# Altium schematic sheet MicroPlayerSCH.SchDoc
size A2; SheetNumber: 1; SheetTotal: 1
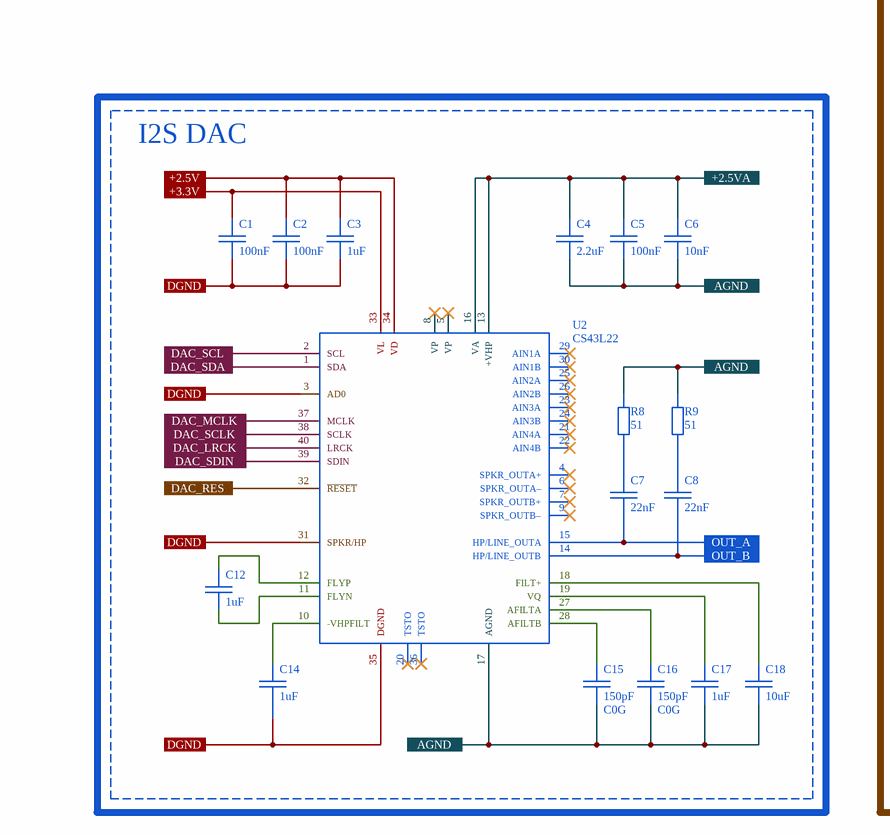
[diagram p0: MicroPlayerSCH.SchDoc, top left]
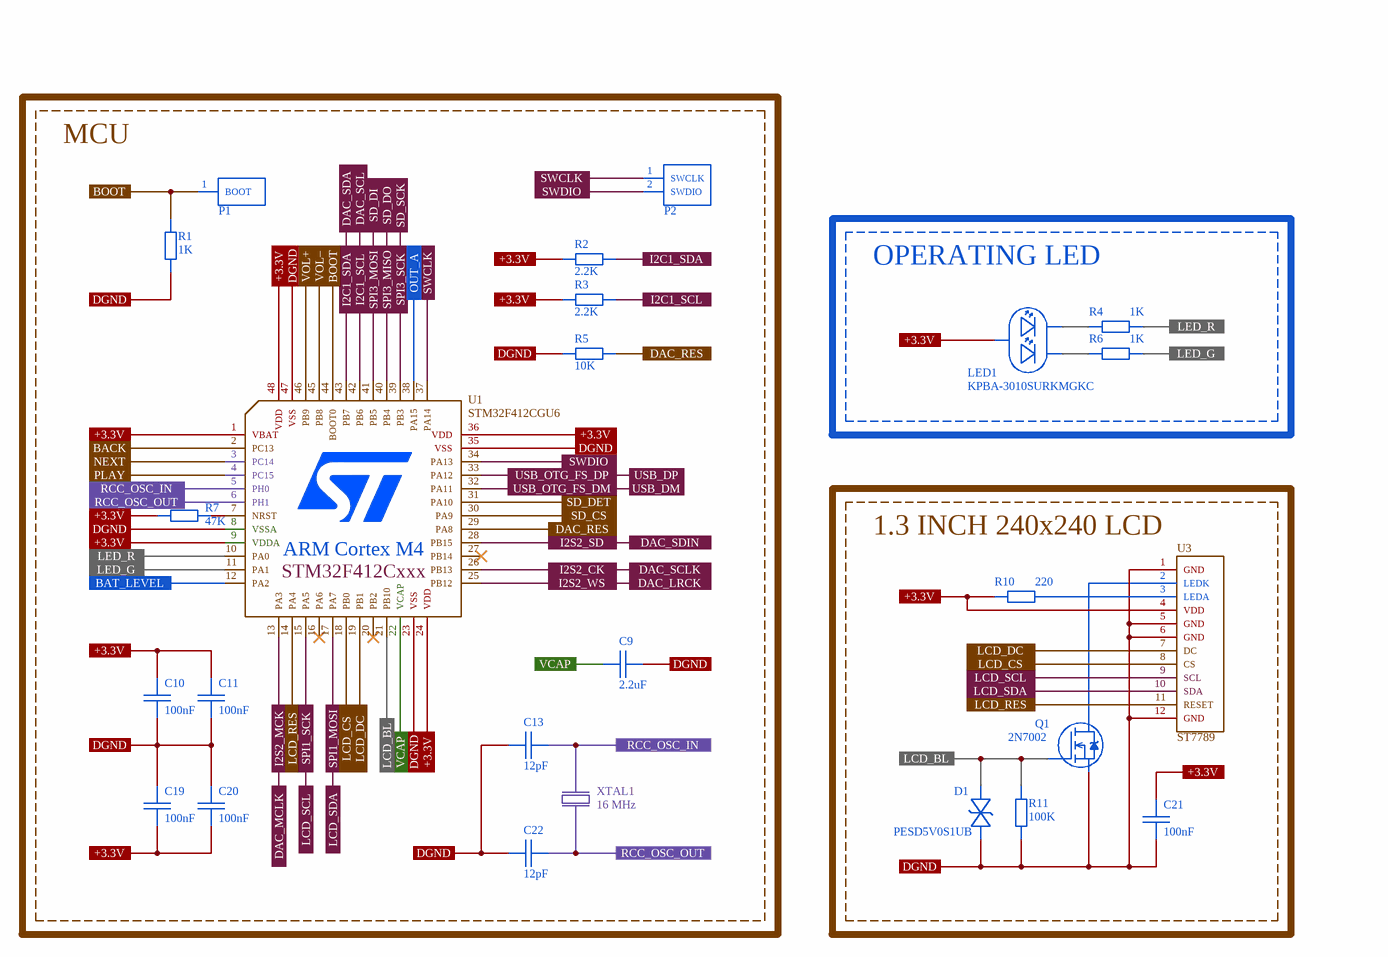
[diagram p1: MicroPlayerSCH.SchDoc, top right]
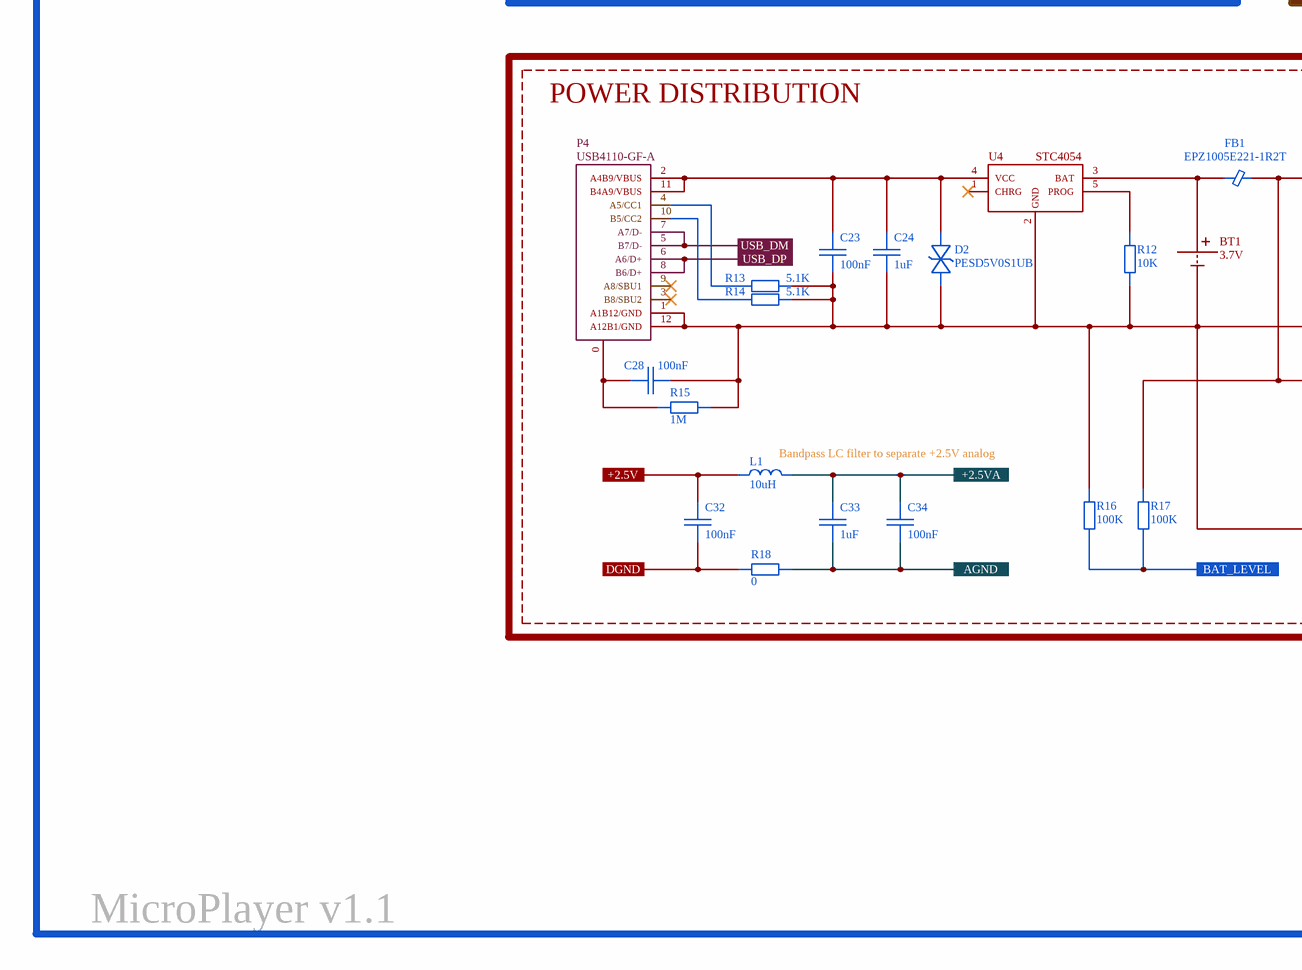
[diagram p2: MicroPlayerSCH.SchDoc, bottom left]
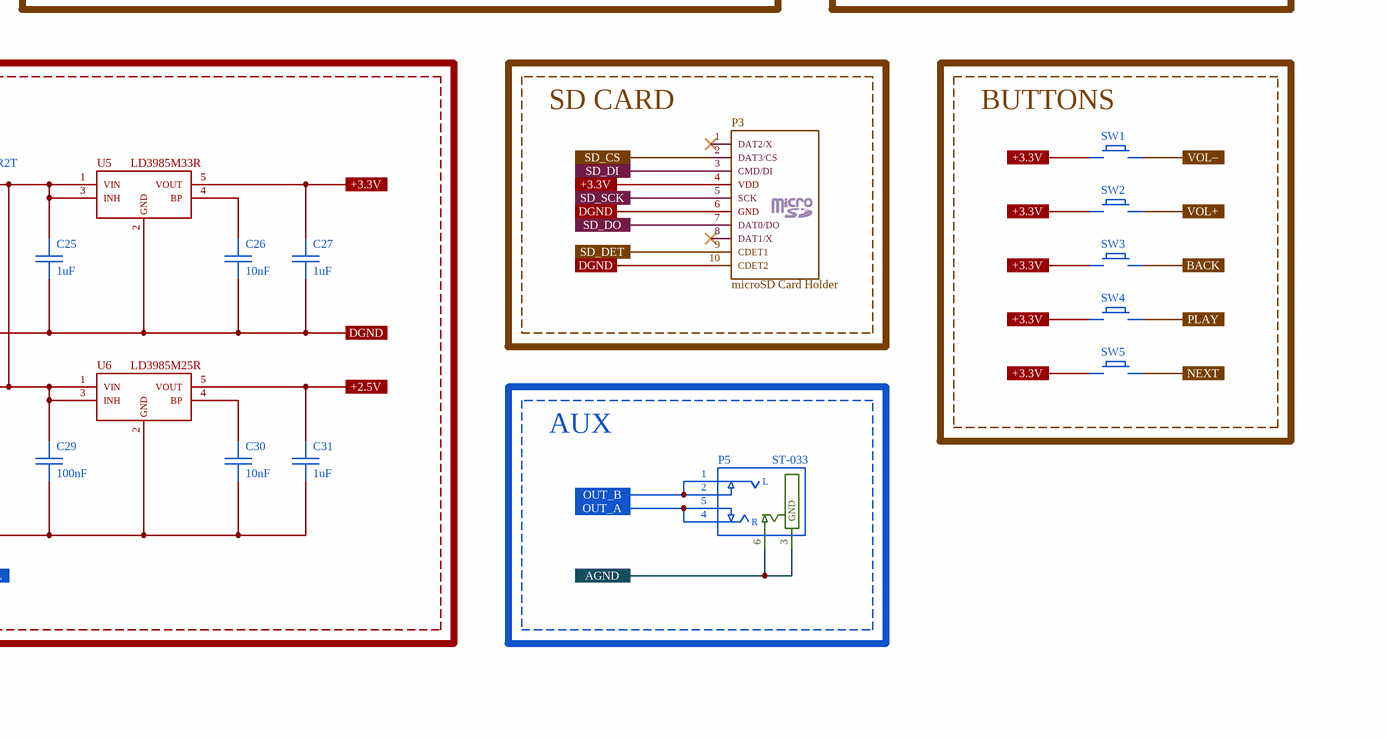
[diagram p3: MicroPlayerSCH.SchDoc, bottom right]

## Parts
BT1  3.7V  [_2-PAD-SM]
C1  100nF  [C0402]
C2  100nF  [C0402]
C3  1uF  [C0402]
C4  2.2uF  [C0402]
C5  100nF  [C0402]
C6  10nF  [C0402]
C7  22nF  [C0402]
C8  22nF  [C0402]
C9  2.2uF  [C0402]
C10  100nF  [C0402]
C11  100nF  [C0402]
C12  1uF  [C0402]
C13  12pF  [C0402]
C14  1uF  [C0402]
C15  150pF  Note: C0G  [C0402]
C16  150pF  Note: C0G  [C0402]
C17  1uF  [C0402]
C18  10uF  [C0402]
C19  100nF  [C0402]
C20  100nF  [C0402]
C21  100nF  [C0402]
C22  12pF  [C0402]
C23  100nF  [C0402]
C24  1uF  [C0402]
C25  1uF  [C0402]
C26  10nF  [C0402]
C27  1uF  [C0402]
C28  100nF  [C0402]
C29  100nF  [C0402]
C30  10nF  [C0402]
C31  1uF  [C0402]
C32  100nF  [C0402]
C33  1uF  [C0402]
C34  100nF  [C0402]
D1  PESD5V0S1UB  [SOD-523]
D2  PESD5V0S1UB  [SOD-523]
FB1  EPZ1005E221-1R2T  [L0402]
L1  10uH  [L0402]
LED1  KPBA-3010SURKMGKC  [LED-3010]
P1  P1  [_1-PAD-SM]  (value not drawn)
P2  P2  [_2-PAD-SM]  (value not drawn)
P3  microSD Card Holder  [SD-05]
P4  USB4110-GF-A  [USB-TYPE-C]
P5  ST-033  [_3-PAD-TH]
Q1  2N7002  [SOT-23-3-312]
R1  1K  [R0402]
R2  2.2K  [R0402]
R3  2.2K  [R0402]
R4  1K  [R0402]
R5  10K  [R0402]
R6  1K  [R0402]
R7  47K  [R0402]
R8  51  [R0402]
R9  51  [R0402]
R10  220  [R0402]
R11  100K  [R0402]
R12  10K  [R0402]
R13  5.1K  [R0402]
R14  5.1K  [R0402]
R15  1M  [R0402]
R16  100K  [R0402]
R17  100K  [R0402]
R18  0  [R0402]
SW1  (no value)  [BUT-SMD-4X3.5X2MM]
SW2  (no value)  [BUT-SMD-4X3.5X2MM]
SW3  (no value)  [BUT-SMD-4X3.5X2MM]
SW4  (no value)  [BUT-SMD-4X3.5X2MM]
SW5  (no value)  [BUT-SMD-4X3.5X2MM]
U1  STM32F412CGU6  [UFQFPN48]
U2  CS43L22  [QFN40]
U3  ST7789  [1.3INCH_LCD_WELDED]
U4  STC4054  [SOT-23-5]
U5  LD3985M33R  [SOT-23-5]
U6  LD3985M25R  [SOT-23-5]
XTAL1  16 MHz  [7U]

## Blocks framed on the sheet
MCU: C9-C11 C13 C19 C20 C22 P1 P2 R1-R3 R5 R7 U1 XTAL1
I2S DAC: C1-C8 C12 C14-C18 R8 R9 U2
OPERATING LED: LED1 R4 R6
1.3 INCH 240x240 LCD: C21 D1 Q1 R10 R11 U3
POWER DISTRIBUTION: BT1 C23-C34 D2 FB1 L1 P4 R12-R18 U4-U6
SD CARD: P3
BUTTONS: SW1-SW5
AUX: P5

## Ports
+2.5V (see MicroPlayerSCH[2A], MicroPlayerSCH[2D]), +2.5V (see MicroPlayerSCH[2A], MicroPlayerSCH[5C]), +2.5V (see MicroPlayerSCH[2D], MicroPlayerSCH[5C]), +2.5VA (see MicroPlayerSCH[3A]), +2.5VA (see MicroPlayerSCH[3D]), +3.3V (see MicroPlayerSCH[2B], MicroPlayerSCH[4B], MicroPlayerSCH[4C], MicroPlayerSCH[5A], MicroPlayerSCH[5B], MicroPlayerSCH[5C], MicroPlayerSCH[6B], MicroPlayerSCH[7B], MicroPlayerSCH[7C]), +3.3V (see MicroPlayerSCH[2B], MicroPlayerSCH[4B], MicroPlayerSCH[4C], MicroPlayerSCH[5A], MicroPlayerSCH[5B], MicroPlayerSCH[5C], MicroPlayerSCH[6B], MicroPlayerSCH[7C]), +3.3V (see MicroPlayerSCH[2B], MicroPlayerSCH[4B], MicroPlayerSCH[5A], MicroPlayerSCH[5B], MicroPlayerSCH[5C], MicroPlayerSCH[6B], MicroPlayerSCH[7B], MicroPlayerSCH[7C]), +3.3V (see MicroPlayerSCH[4B], MicroPlayerSCH[4C], MicroPlayerSCH[5A], MicroPlayerSCH[5B], MicroPlayerSCH[5C], MicroPlayerSCH[6B], MicroPlayerSCH[7B], MicroPlayerSCH[7C]), AGND (see MicroPlayerSCH[3B], MicroPlayerSCH[3C], MicroPlayerSCH[3D]), AGND (see MicroPlayerSCH[3B], MicroPlayerSCH[3C], MicroPlayerSCH[3D], MicroPlayerSCH[5D]), AGND (see MicroPlayerSCH[3B], MicroPlayerSCH[3C], MicroPlayerSCH[5D]), AGND (see MicroPlayerSCH[3B], MicroPlayerSCH[3D], MicroPlayerSCH[5D]), BACK (see MicroPlayerSCH[4B]), BACK (see MicroPlayerSCH[7C]), BAT_LEVEL (see MicroPlayerSCH[4B]), BAT_LEVEL (see MicroPlayerSCH[4D]), BOOT (see MicroPlayerSCH[4A]), BOOT (see MicroPlayerSCH[5A]), DAC_LRCK (see MicroPlayerSCH[2B]), DAC_LRCK (see MicroPlayerSCH[6B]), DAC_MCLK (see MicroPlayerSCH[2B]), DAC_MCLK (see MicroPlayerSCH[5C]), DAC_RES (see MicroPlayerSCH[2B], MicroPlayerSCH[5B]), DAC_RES (see MicroPlayerSCH[2B], MicroPlayerSCH[6B]), DAC_RES (see MicroPlayerSCH[5B], MicroPlayerSCH[6B]), DAC_SCL (see MicroPlayerSCH[2B]), DAC_SCL (see MicroPlayerSCH[5A]), DAC_SCLK (see MicroPlayerSCH[2B]), DAC_SCLK (see MicroPlayerSCH[6B]), DAC_SDA (see MicroPlayerSCH[2B]), DAC_SDA (see MicroPlayerSCH[5A]), DAC_SDIN (see MicroPlayerSCH[2B]), DAC_SDIN (see MicroPlayerSCH[6B]), DGND (see MicroPlayerSCH[2B], MicroPlayerSCH[2C], MicroPlayerSCH[2D], MicroPlayerSCH[4A], MicroPlayerSCH[4B], MicroPlayerSCH[5A], MicroPlayerSCH[5B], MicroPlayerSCH[5C], MicroPlayerSCH[6B]), DGND (see MicroPlayerSCH[2B], MicroPlayerSCH[2C], MicroPlayerSCH[2D], MicroPlayerSCH[4A], MicroPlayerSCH[4B], MicroPlayerSCH[5A], MicroPlayerSCH[5B], MicroPlayerSCH[5C], MicroPlayerSCH[6B], MicroPlayerSCH[6C]), DGND (see MicroPlayerSCH[2B], MicroPlayerSCH[2C], MicroPlayerSCH[2D], MicroPlayerSCH[4A], MicroPlayerSCH[4B], MicroPlayerSCH[5A], MicroPlayerSCH[5B], MicroPlayerSCH[5C], MicroPlayerSCH[6C]), DGND (see MicroPlayerSCH[2B], MicroPlayerSCH[2C], MicroPlayerSCH[2D], MicroPlayerSCH[4A], MicroPlayerSCH[4B], MicroPlayerSCH[5B], MicroPlayerSCH[5C], MicroPlayerSCH[6B], MicroPlayerSCH[6C]), DGND (see MicroPlayerSCH[2B], MicroPlayerSCH[2C], MicroPlayerSCH[2D], MicroPlayerSCH[4B], MicroPlayerSCH[5A], MicroPlayerSCH[5B], MicroPlayerSCH[5C], MicroPlayerSCH[6B], MicroPlayerSCH[6C]), DGND (see MicroPlayerSCH[2B], MicroPlayerSCH[2C], MicroPlayerSCH[4A], MicroPlayerSCH[4B], MicroPlayerSCH[5A], MicroPlayerSCH[5B], MicroPlayerSCH[5C], MicroPlayerSCH[6B], MicroPlayerSCH[6C]), DGND (see MicroPlayerSCH[2B], MicroPlayerSCH[2D], MicroPlayerSCH[4A], MicroPlayerSCH[4B], MicroPlayerSCH[5A], MicroPlayerSCH[5B], MicroPlayerSCH[5C], MicroPlayerSCH[6B], MicroPlayerSCH[6C]), I2C1_SCL (see MicroPlayerSCH[5B]), I2C1_SCL (see MicroPlayerSCH[6A]), I2C1_SDA (see MicroPlayerSCH[5B]), I2C1_SDA (see MicroPlayerSCH[6A]), I2S2_CK, I2S2_MCK, I2S2_SD, I2S2_WS, LCD_BL (see MicroPlayerSCH[5B]), LCD_BL (see MicroPlayerSCH[6B]), LCD_CS (see MicroPlayerSCH[5B]), LCD_CS (see MicroPlayerSCH[6B]), LCD_DC (see MicroPlayerSCH[5B]), LCD_DC (see MicroPlayerSCH[6B]), LCD_RES (see MicroPlayerSCH[5B]), LCD_RES (see MicroPlayerSCH[6B]), LCD_SCL (see MicroPlayerSCH[5C]), LCD_SCL (see MicroPlayerSCH[6B]), LCD_SDA (see MicroPlayerSCH[5C]), LCD_SDA (see MicroPlayerSCH[6B]), LED_G (see MicroPlayerSCH[4B]), LED_G (see MicroPlayerSCH[7B]), LED_R (see MicroPlayerSCH[4B]), LED_R (see MicroPlayerSCH[7B]), NEXT (see MicroPlayerSCH[4B]), NEXT (see MicroPlayerSCH[7C]), OUT_A (see MicroPlayerSCH[3B], MicroPlayerSCH[5A]), OUT_A (see MicroPlayerSCH[3B], MicroPlayerSCH[5D]), OUT_A (see MicroPlayerSCH[5A], MicroPlayerSCH[5D]), OUT_B (see MicroPlayerSCH[3B]), OUT_B (see MicroPlayerSCH[5D]), PLAY (see MicroPlayerSCH[4B]), PLAY (see MicroPlayerSCH[7C]), RCC_OSC_IN (see MicroPlayerSCH[4B]), RCC_OSC_IN (see MicroPlayerSCH[5B]), RCC_OSC_OUT (see MicroPlayerSCH[4B]), RCC_OSC_OUT (see MicroPlayerSCH[5C]), SD_CS (see MicroPlayerSCH[5B]), SD_CS (see MicroPlayerSCH[5C]), SD_DET (see MicroPlayerSCH[5B]), SD_DET (see MicroPlayerSCH[5C]), SD_DI (see MicroPlayerSCH[5A]), SD_DI (see MicroPlayerSCH[5C]), SD_DO (see MicroPlayerSCH[5A]), SD_DO (see MicroPlayerSCH[5C]), SD_SCK (see MicroPlayerSCH[5A]), SD_SCK (see MicroPlayerSCH[5C]), SPI1_MOSI, SPI1_SCK, SPI3_MISO, SPI3_MOSI, SPI3_SCK, SWCLK (see MicroPlayerSCH[5A]), SWDIO (see MicroPlayerSCH[5A]), SWDIO (see MicroPlayerSCH[5B]), USB_DM (see MicroPlayerSCH[2C]), USB_DM (see MicroPlayerSCH[6B]), USB_DP (see MicroPlayerSCH[2C]), USB_DP (see MicroPlayerSCH[6B]), USB_OTG_FS_DM, USB_OTG_FS_DP, VCAP (see MicroPlayerSCH[5B]), VOL+ (see MicroPlayerSCH[5A]), VOL+ (see MicroPlayerSCH[7C]), VOL– (see MicroPlayerSCH[5A]), VOL– (see MicroPlayerSCH[7C])

## Nets
+2.5V: C2.2 C3.2 C31.2 C32.1 L1.1 U2.34(VD) U6.5(VOUT) ; port +2.5V
+2.5VA: C4.2 C5.2 C6.2 C33.1 C34.1 L1.2 U2.13(+VHP) U2.16(VA) ; port +2.5VA
+3.3V: C1.2 C10.2 C11.2 C19.1 C20.1 C21.2 C27.2 LED1.1 P3.4(VDD) R2.1 R3.1 R7.1 R10.1 SW1.1 SW2.1 SW3.1 SW4.1 SW5.1 U1.1(VBAT) U1.9(VDDA) U1.24(VDD) U1.36(VDD) U1.48(VDD) U2.33(VL) U3.4(VDD) U5.5(VOUT) ; port +3.3V
AGND: C4.1 C5.1 C6.1 C15.1 C16.1 C17.2 C18.2 C33.2 C34.2 P5.3(GND) P5.6 R8.2 R9.2 R18.2 U2.17(AGND) ; port AGND
BACK: SW3.2 U1.2(PC13) ; port BACK
BAT_LEVEL: R16.1 R17.1 U1.12(PA2) ; port BAT_LEVEL
BOOT: P1.1(BOOT) R1.1 U1.44(BOOT0) ; port BOOT
DAC_LRCK: U1.25(PB12) U2.40(LRCK) ; port DAC_LRCK, port I2S2_WS
DAC_MCLK: U1.13(PA3) U2.37(MCLK) ; port DAC_MCLK, port I2S2_MCK
DAC_RES: R5.2 U1.29(PA8) U2.32(~{RESET}) ; port DAC_RES
DAC_SCL: R3.2 U1.42(PB6) U2.2(SCL) ; port DAC_SCL, port I2C1_SCL
DAC_SCLK: U1.26(PB13) U2.38(SCLK) ; port DAC_SCLK, port I2S2_CK
DAC_SDA: R2.2 U1.43(PB7) U2.1(SDA) ; port DAC_SDA, port I2C1_SDA
DAC_SDIN: U1.28(PB15) U2.39(SDIN) ; port DAC_SDIN, port I2S2_SD
DGND: BT1.2 C1.1 C2.1 C3.1 C9.2 C10.1 C11.1 C13.2 C14.1 C19.2 C20.2 C21.1 C22.2 C23.1 C24.2 C25.1 C26.1 C27.1 C28.1 C29.1 C30.1 C31.1 C32.2 D1.1 D2.1 P3.6(GND) P3.10(CDET2) P4.1(A1B12/GND) P4.12(A12B1/GND) Q1.2(S) R1.2 R5.1 R11.1 R12.1 R13.1 R14.1 R15.1 R16.2 R18.1 U1.8(VSSA) U1.23(VSS) U1.35(VSS) U1.47(VSS) U2.3(AD0) U2.31(SPKR/HP) U2.35(DGND) U3.1(GND) U3.5(GND) U3.6(GND) U3.12(GND) U4.2(GND) U5.2(GND) U6.2(GND) ; port DGND
LCD_BL: D1.2 Q1.1(G) R11.2 U1.21(PB10) ; port LCD_BL
LCD_CS: U1.18(PB0) U3.8(CS) ; port LCD_CS
LCD_DC: U1.19(PB1) U3.7(DC) ; port LCD_DC
LCD_RES: U1.14(PA4) U3.11(RESET) ; port LCD_RES
LCD_SCL: U1.15(PA5) U3.9(SCL) ; port SPI1_SCK, port LCD_SCL
LCD_SDA: U1.17(PA7) U3.10(SDA) ; port SPI1_MOSI, port LCD_SDA
LED_G: R6.1 U1.11(PA1) ; port LED_G
LED_R: R4.2 U1.10(PA0) ; port LED_R
NEXT: SW5.2 U1.3(PC14) ; port NEXT
OUT_A: C7.1 P5.4(R) P5.5 U1.38(PA15) U2.15(HP/LINE_OUTA) ; port OUT_A
OUT_B: C8.1 P5.1(L) P5.2 U2.14(HP/LINE_OUTB) ; port OUT_B
PLAY: SW4.2 U1.4(PC15) ; port PLAY
RCC_OSC_IN: C13.1 U1.5(PH0) XTAL1.1 ; port RCC_OSC_IN
RCC_OSC_OUT: C22.1 U1.6(PH1) XTAL1.2 ; port RCC_OSC_OUT
SD_CS: P3.2(DAT3/CS) U1.30(PA9) ; port SD_CS
SD_DET: P3.9(CDET1) U1.31(PA10) ; port SD_DET
SD_DI: P3.3(CMD/DI) U1.41(PB5) ; port SPI3_MOSI, port SD_DI
SD_DO: P3.7(DAT0/DO) U1.40(PB4) ; port SPI3_MISO, port SD_DO
SD_SCK: P3.5(SCK) U1.39(PB3) ; port SPI3_SCK, port SD_SCK
SWCLK: P2.1(SWCLK) U1.37(PA14) ; port SWCLK
SWDIO: P2.2(SWDIO) U1.34(PA13) ; port SWDIO
USB_DM: P4.5(B7/D-) P4.7(A7/D-) U1.32(PA11) ; port USB_DM, port USB_OTG_FS_DM
USB_DP: P4.6(A6/D+) P4.8(B6/D+) U1.33(PA12) ; port USB_DP, port USB_OTG_FS_DP
VCAP: C9.1 U1.22(VCAP) ; port VCAP
VOL+: SW2.2 U1.46(PB9) ; port VOL+
VOL–: SW1.2 U1.45(PB8) ; port VOL–
NetBT1_1: BT1.1 FB1.1 U4.3(BAT)
NetC7_2: C7.2 R8.1
NetC8_2: C8.2 R9.1
NetC12_1: C12.1 U2.11(FLYN)
NetC12_2: C12.2 U2.12(FLYP)
NetC14_2: C14.2 U2.10(-VHPFILT)
NetC15_2: C15.2 U2.28(AFILTB)
NetC16_2: C16.2 U2.27(AFILTA)
NetC17_1: C17.1 U2.19(VQ)
NetC18_1: C18.1 U2.18(FILT+)
NetC23_2: C23.2 C24.1 D2.2 P4.2(A4B9/VBUS) P4.11(B4A9/VBUS) U4.4(VCC)
NetC25_2: C25.2 C29.2 FB1.2 R17.2 U5.1(VIN) U5.3(INH) U6.1(VIN) U6.3(INH)
NetC26_2: C26.2 U5.4(BP)
NetC28_2: C28.2 P4.0 R15.2
NetC30_2: C30.2 U6.4(BP)
NetLED1_2: LED1.2 R4.1
NetLED1_3: LED1.3 R6.2
NetP4_4: P4.4(A5/CC1) R13.2
NetP4_10: P4.10(B5/CC2) R14.2
NetQ1_3: Q1.3(D) U3.2(LEDK)
NetR7_2: R7.2 U1.7(NRST)
NetR10_2: R10.2 U3.3(LEDA)
NetR12_2: R12.2 U4.5(PROG)

Not connected (* = marked no-connect by the designer): P3 1(DAT2/X)* 8(DAT1/X)*; P4 3(B8/SBU2)* 9(A8/SBU1)*; U1 16(PA6)* 20(PB2)* 27(PB14)*; U2 4(SPKR_OUTA+)* 5(VP)* 6(SPKR_OUTA–)* 7(SPKR_OUTB+)* 8(VP)* 9(SPKR_OUTB–)* 20(TSTO)* 21(AIN4A)* 22(AIN4B)* 23(AIN3A)* 24(AIN3B)* 25(AIN2A)* 26(AIN2B)* 29(AIN1A)* 30(AIN1B)* 36(TSTO)*; U4 1(CHRG)*

## Notes on the sheet
- (near L1) Bandpass LC filter to separate +2.5V analog
- MicroPlayer v1.1
- (in symbol STM32F412Cxxx) ARM Cortex M4

## Library data of the parts
BT1 = Battery: Name: LP303030; Value: 3.7V; Link: https://www.chipdip.ru/product/robiton-lp303030
C1-C34 = Cap: Voltage: 250V; Tolerance: 5%
  C1 C2 C5 C10 C11 C19-C21 C23 C28 C29: Value: 100nF; Case: DNP; Part Number: N/A; Link: *; Note: *
  C3 C12 C14 C24 C25 C27 C31: Value: 1uF; Case: DNP; Part Number: N/A; Link: *; Note: *
  C4 C9: Value: 2.2uF; Case: DNP; Part Number: N/A; Link: *; Note: *
  C6 C26 C30: Value: 10nF; Case: DNP; Part Number: N/A; Link: *; Note: *
  C7 C8: Value: 22nF; Case: DNP; Part Number: N/A; Link: *; Note: *
  C13 C22: Value: 12pF; Case: 0603
  C15 C16: Value: 150pF; Case: DNP; Part Number: N/A; Link: *
  C17 C33: Value: 1uF; Case: 0603
  C18: Value: 10uF; Case: 0603
  C32 C34: Value: 100nF; Case: 0603
D1 D2 = Suppressor: Name: PESD5V0S1UB; Case: SOD-523; Link: https://www.chipdip.ru/product/pesd5v0s1ub
FB1 = Ferrite Bead: Value: 100uH; Name: EPZ1005E221-1R2T; Case: 0402
L1 = Inductor: Part Number: LQM21FN100N00K; Tolerance: 30%; Value: 10uH; Case: 0805; Link: https://www.chipdip.ru/product/lqm21fn100n
LED1 = LED-2C-CA: Name: KPBA-3010SURKMGKC; Case: DNP; Part Number: N/A; Link: N/A
P2 = P2: Name: DS1021; Case: DNP; Part Number: N/A; Link: *; Note: *
P3 = MicroSD-CD2: Name: microSD Card Holder
P4 = USB Type C with 0: Name: USB4110-GF-A; Case: DNP; Part Number: N/A; Link: *; Note: *
P5 = AJack Socket Stereo: Name: ST-033
Q1 = MOSFET-N: Name: 2N7002; Case: SOT-23-5; Link: https://www.chipdip.ru/product/2n7002-umw
R1-R18 = Res: Tolerance: 5%; Power: 0.125W
  R1: Value: 1K
  R2 R3: Value: 2.2K
  R4 R6: Value: 1K; Case: 0603
  R5 R12: Value: 10K
  R7: Value: 47K
  R8 R9: Value: 51
  R10: Value: 220
  R11 R16 R17: Value: 100K
  R13 R14: Value: 5.1K
  R15: Value: 1M
  R18: Value: 0; Case: 0603
SW1-SW5 = Button
U1 = STM32F412Cxxx: Name: STM32F412CGU6; Case: DNP; Part Number: N/A
U2 = CS43L22: Low Power, Stereo DAC w/Headphone & Speaker Amps; Name: CS43L22; Case: DNP; Part Number: N/A
U3 = 1.3inch TFT LCD 12-pin: 135x240 Display; Name: ST7789; Part Number: N/A
U4 = STC4054: 800mA Standalone linear Li-Ion Battery charger with thermal regulation; Name: STC4054; Case: SOT-23-5; Part Number: N/A
U5 U6 = LD3985: Ultra low drop and low noise BiCMOS voltage regulators, 150 mA; Case: SOT-23-5
  U5: Name: LD3985M33R; Link: https://www.chipdip.ru/product/ld3985m33r
  U6: Name: LD3985M25R; Link: https://www.chipdip.ru/product/ld3985m25r
XTAL1 = Crystal: Name: SJK-7U; Tolerance: 0.001%; Value: 16 MHz; Case: 7U; Part Number: N/A
P1 = P1: Case: DNP